# EAGLE design ac and dc measurement (EAGLE 6.2)
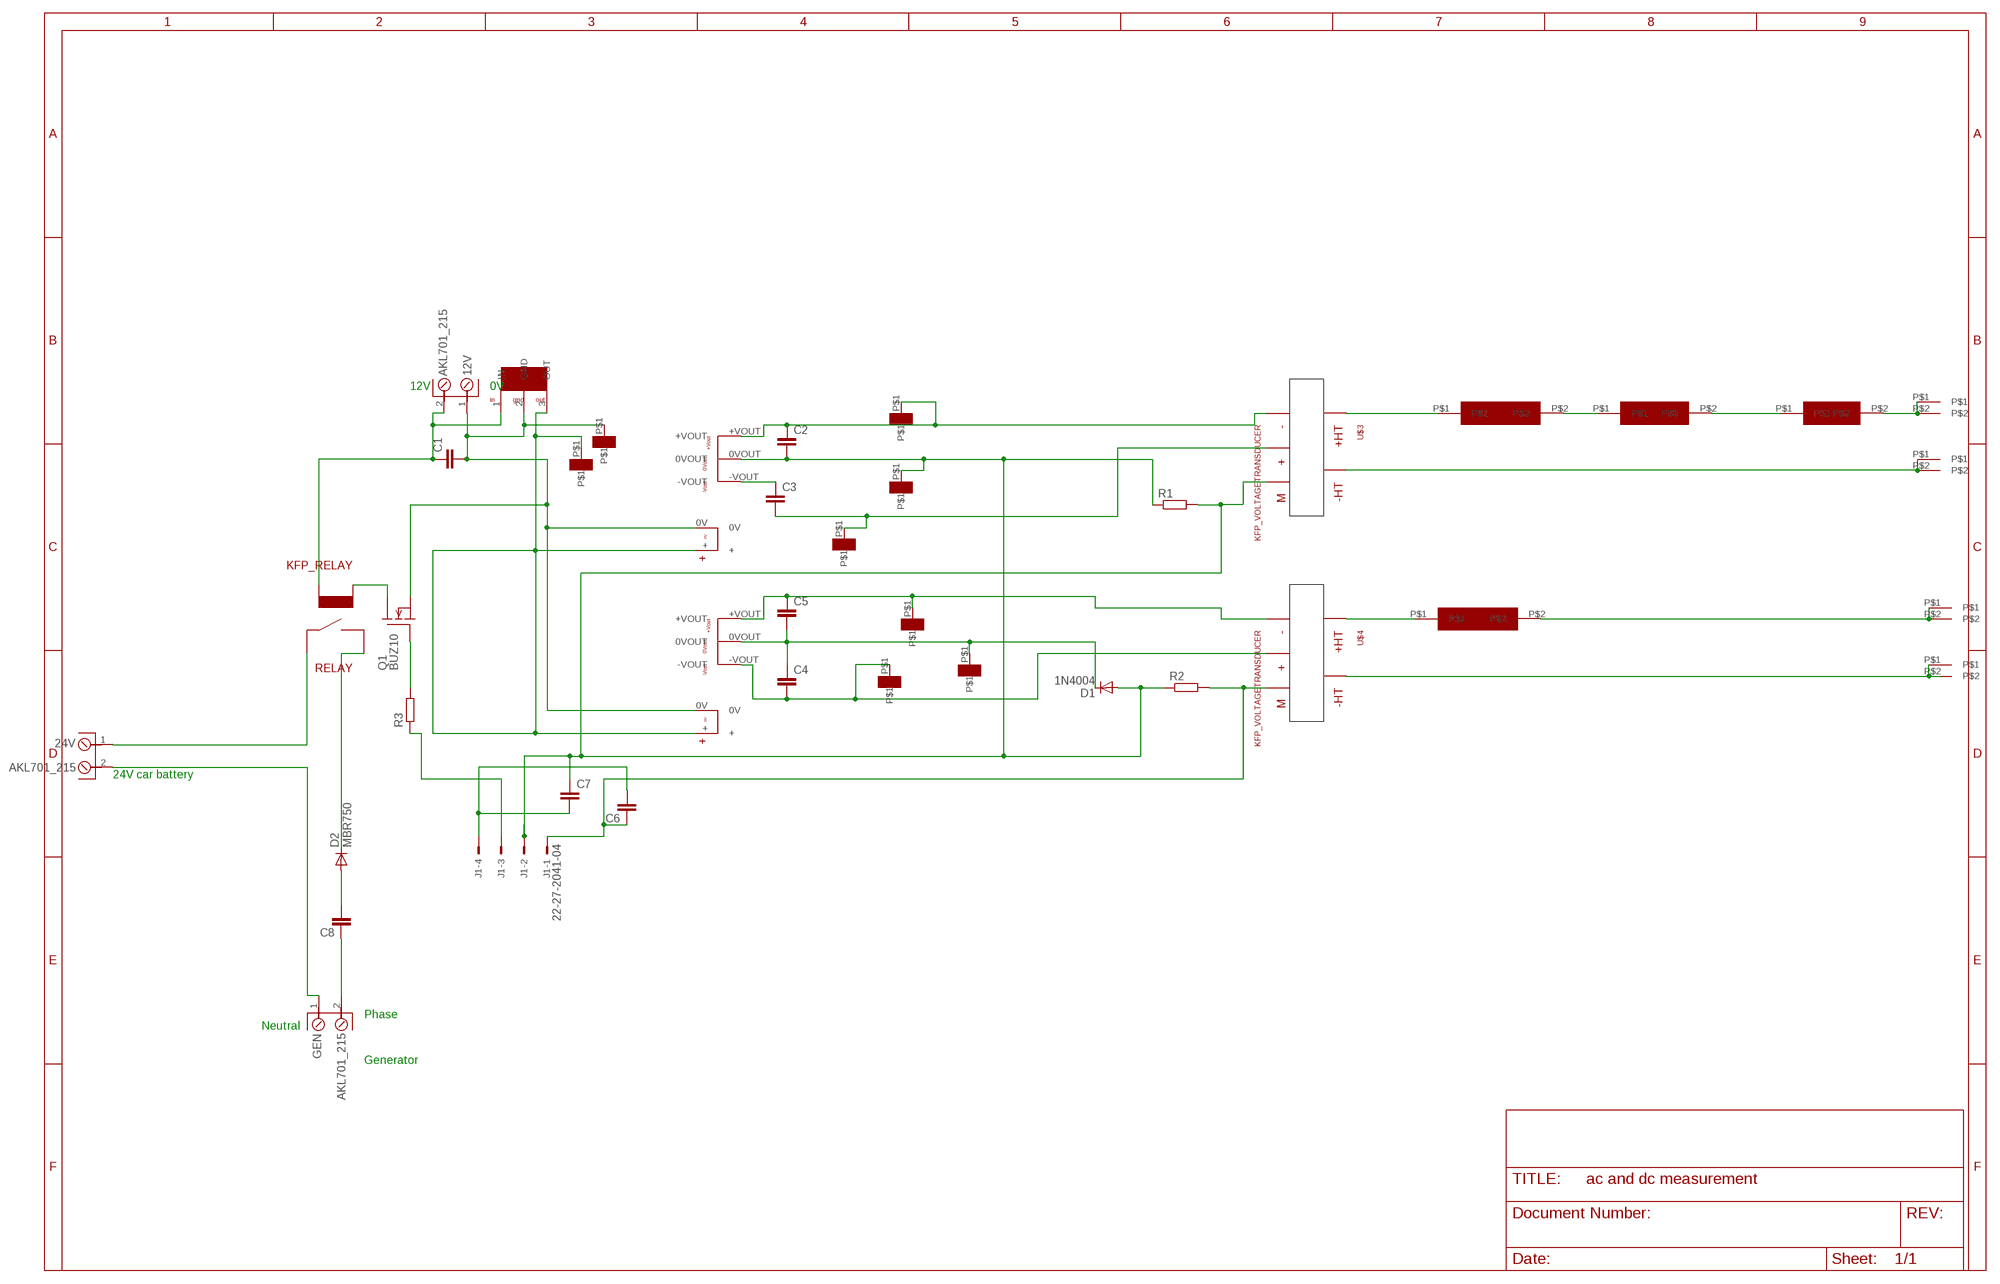
[diagram p0: schematic, sheet 1]

## Parts
5V  KFP_VOL_REG  [TO220]
12V  AKL701_215  [AKL701_2_15]
24V  AKL701_215  [AKL701_2_15]
C1  C-EU025-024X044  [C025-024X044]
C2  C-EU025-024X044  [C025-024X044]
C3  C-EU025-024X044  [C025-024X044]
C4  C-EU025-024X044  [C025-024X044]
C5  C-EU025-024X044  [C025-024X044]
C6  C-EU025-024X044  [C025-024X044]
C7  C-EU025-024X044  [C025-024X044]
C8  C-EU025-030X050  [C025-030X050]
D1  1N4004  [DO41-10]
D2  MBR750  [TO220AC]
GEN  AKL701_215  [AKL701_2_15]
J1  22-27-2041-04  [6410-04]
Q1  BUZ10  [TO220]
R1  R-EU_0204/7  [0204/7]
R2  R-EU_0204/7  [0204/7]
R3  R-EU_0204/7  [0204/7]
RELAY  KFP_RELAY  [KFP_RELAYSPST]
U$1  KFP_DC_DC  [KFP_DC-DC]
U$2  KFP_DC_DC  [KFP_DC-DC]
U$3  KFP_VOLTAGETRANSDUCER  [KFP_VOLTAGETRANSDUCER]
U$4  KFP_VOLTAGETRANSDUCER  [KFP_VOLTAGETRANSDUCER]
U$5  KFP_33K  [KFP_33K]
U$6  KFP_33K  [KFP_33K]
U$7  KFP_22K  [KFP_22K]
U$8  KFP_4.7K  [KFP_18K]
U$9  HIGH_AMP_TERMINAL  [HIGH_AMP_TERMINAL]
U$11  HIGH_AMP_TERMINAL  [HIGH_AMP_TERMINAL]
U$12  HIGH_AMP_TERMINAL  [HIGH_AMP_TERMINAL]
U$13  HIGH_AMP_TERMINAL  [HIGH_AMP_TERMINAL]
U$14  KFP_TEST  [KFP_TEST]
U$15  KFP_TEST  [KFP_TEST]
U$16  KFP_TEST  [KFP_TEST]
U$17  KFP_TEST  [KFP_TEST]
U$18  KFP_TEST  [KFP_TEST]
U$19  KFP_TEST  [KFP_TEST]
U$20  KFP_TEST  [KFP_TEST]
U$21  KFP_TEST  [KFP_TEST]

## Nets
N$1: 5V.2(GND) 12V.1 C1.2 Q1.3(S) U$1.0V U$2.0V U$21.P$1
N$2: 5V.3(OUT) U$1.+ U$2.+ U$16.P$1
N$3: C3.2 U$3.+ U$14.P$1
N$4: C4.2 U$2.-VOUT U$4.+ U$18.P$1
N$5: C6.2 C7.2 J1.4
N$6: C2.1 U$1.+VOUT U$3.- U$15.P$1
N$7: C4.1 C5.2 D1.C U$2.0VOUT U$20.P$1
N$8: C5.1 U$2.+VOUT U$4.- U$17.P$1
N$9: 24V.2 GEN.1
N$10 [AC]: U$4.+HT](+HT) U$5.P$1
N$11: C6.1 J1.1 R2.2 U$4.M
N$12 [DC LINK]: U$3.+HT](+HT) U$6.P$1
N$13 [DC LINK]: U$6.P$2 U$7.P$1
N$14: Q1.2(D) RELAY.A1
N$15 [AC]: U$5.P$2 U$12.P$1 U$12.P$2
N$16 [AC]: U$4.-HT U$13.P$1 U$13.P$2
N$17: Q1.1(G) R3.2
N$18 [DC LINK]: U$3.-HT U$11.P$1 U$11.P$2
N$19: C8.1 GEN.2
N$20: C8.2 D2.A
N$21: U$8.P$2 U$9.P$1 U$9.P$2
N$22: C2.2 C7.1 D1.A J1.2 R1.1 R1.2 R2.1 U$1.0VOUT U$3.M U$19.P$1
N$23: C3.1 U$1.-VOUT
N$24: J1.3 R3.1
N$25: 5V.1(IN) 12V.2 C1.1 RELAY.A2
N$26: D2.C RELAY.11
N$27: 24V.1 RELAY.14
RESISTOR [DC LINK]: U$7.P$2 U$8.P$1

## Notes on the sheet
- 12V | 0V
- 24V car battery
- Phase
- Neutral
- Generator

## Library data of the parts
5V = kfp_vol_reg:KFP_VOL_REG
12V 24V GEN = _con_riacon_akl701:AKL701_2*: RIACON (Ria Connect) Screw Type Terminal Block Type AKL 701 - 2 (pole-size: 2) centerline 6.35 mm / 0.250 inches, 400 V / 24 A, horizontal wire entry, lift system, modular packages: _13: recommended pcb hole dia. = 1,3 mm _15: pcb hole dia. = 1,5 mm (prototyping) Auhtor: Dipl.-Ing. FH Rainer Bayer, Hochschule Heilbronn (rainer.bayer@hs-heilbronn.de)
C1-C8 = resistor:C-EU: CAPACITOR, European symbol
D1 = diode:1N4004: DIODE general purpose rectifier, 1 A
D2 = diode:MBR750: DIODE barrier rectifier, 7.5 A, 50 V
J1 = con-molex:22-?-04: CONNECTOR wire to board 2.54 mm (.1 inch) pitch header; OC_FARNELL: unknown; OC_NEWARK: unknown
Q1 = transistor-fet:BUZ10: N-Channel Enhancement MOSFET 50V; 20A; 0,080Ohm
R1-R3 = resistor:R-EU_: RESISTOR, European symbol
RELAY = kfp_relaynew:KFP_RELAY
U$1 U$2 = kfp_ac-dc:KFP_DC_DC
U$3 U$4 = KFP_VOLTAGE TRANSDUCER_1:KFP_VOLTAGETRANSDUCER
U$5 U$6 = kfp_33k_5W:KFP_33K
U$7 = kfp_22k_3W:KFP_22K
U$8 = kfp_4.7k_3W:KFP_4.7K
U$9 U$11-U$13 = rectifier_components:HIGH_AMP_TERMINAL
U$14-U$21 = KFP_TEST:KFP_TEST

## Net classes
1 24V path: width 2.413 mm
2 DC LINK: width 0 mm, clearance 3.632 mm
3 AC: width 0.003 mm, clearance 2.362 mm

## Board
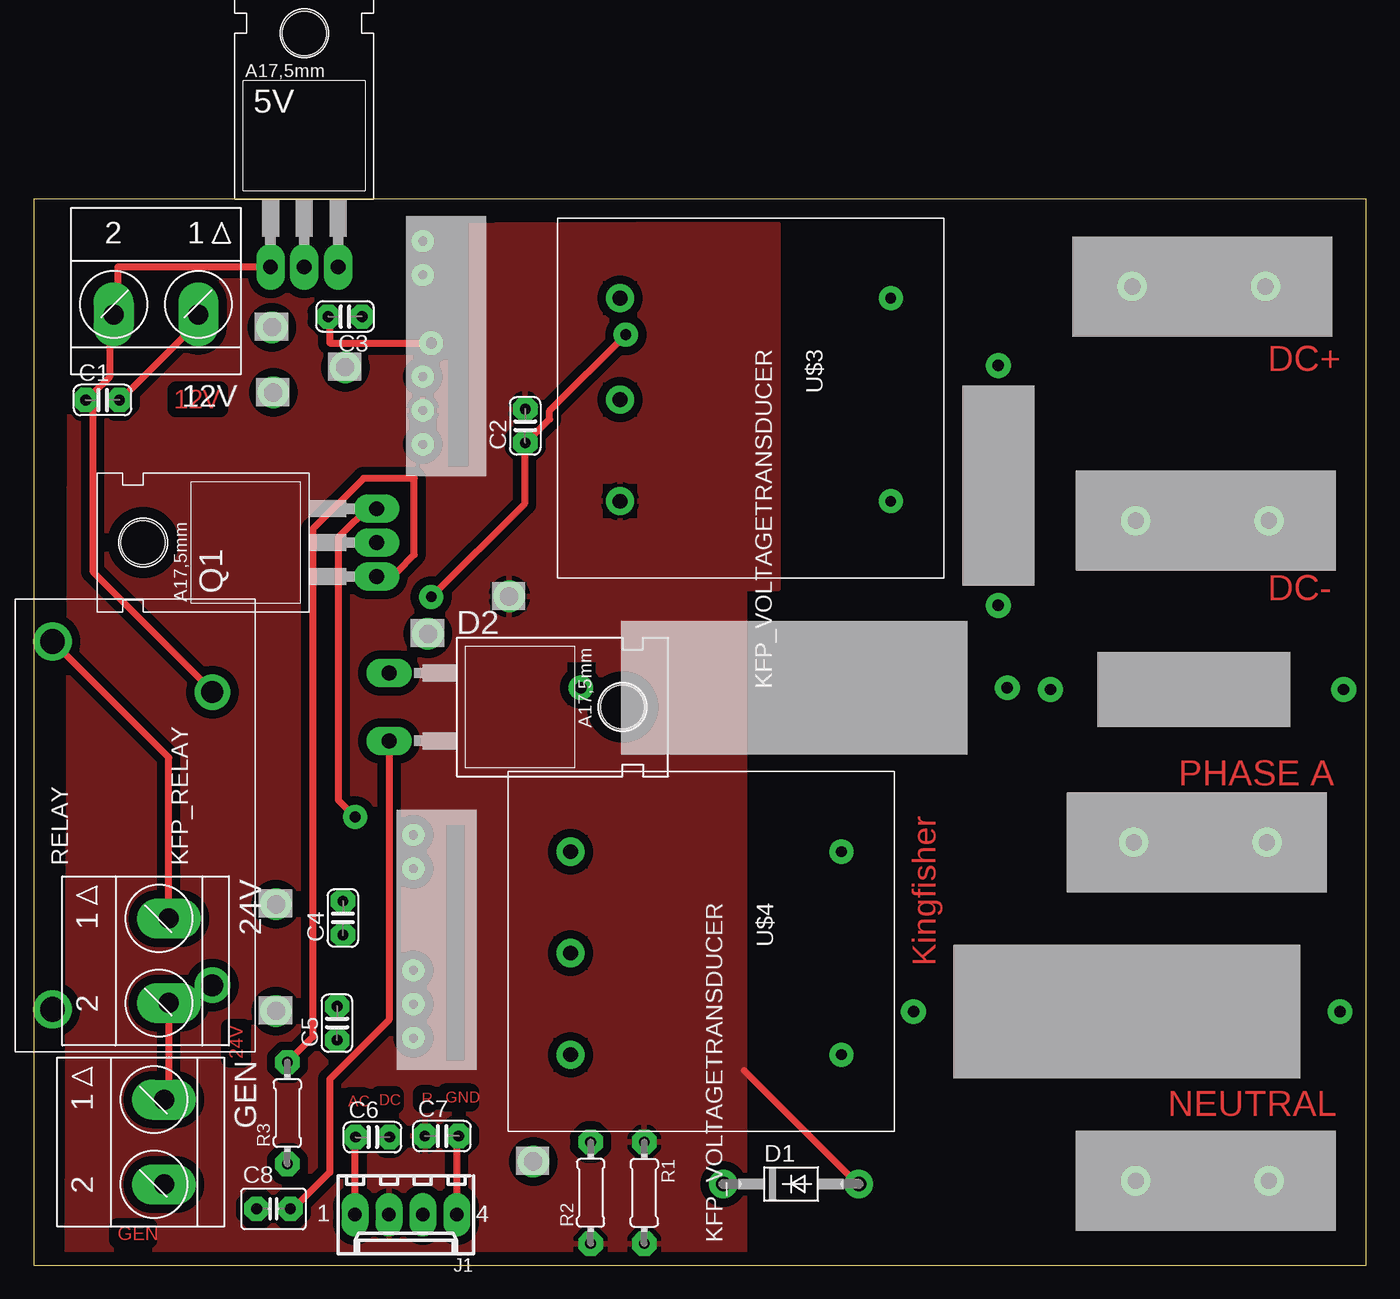
[diagram p1: board, top side]
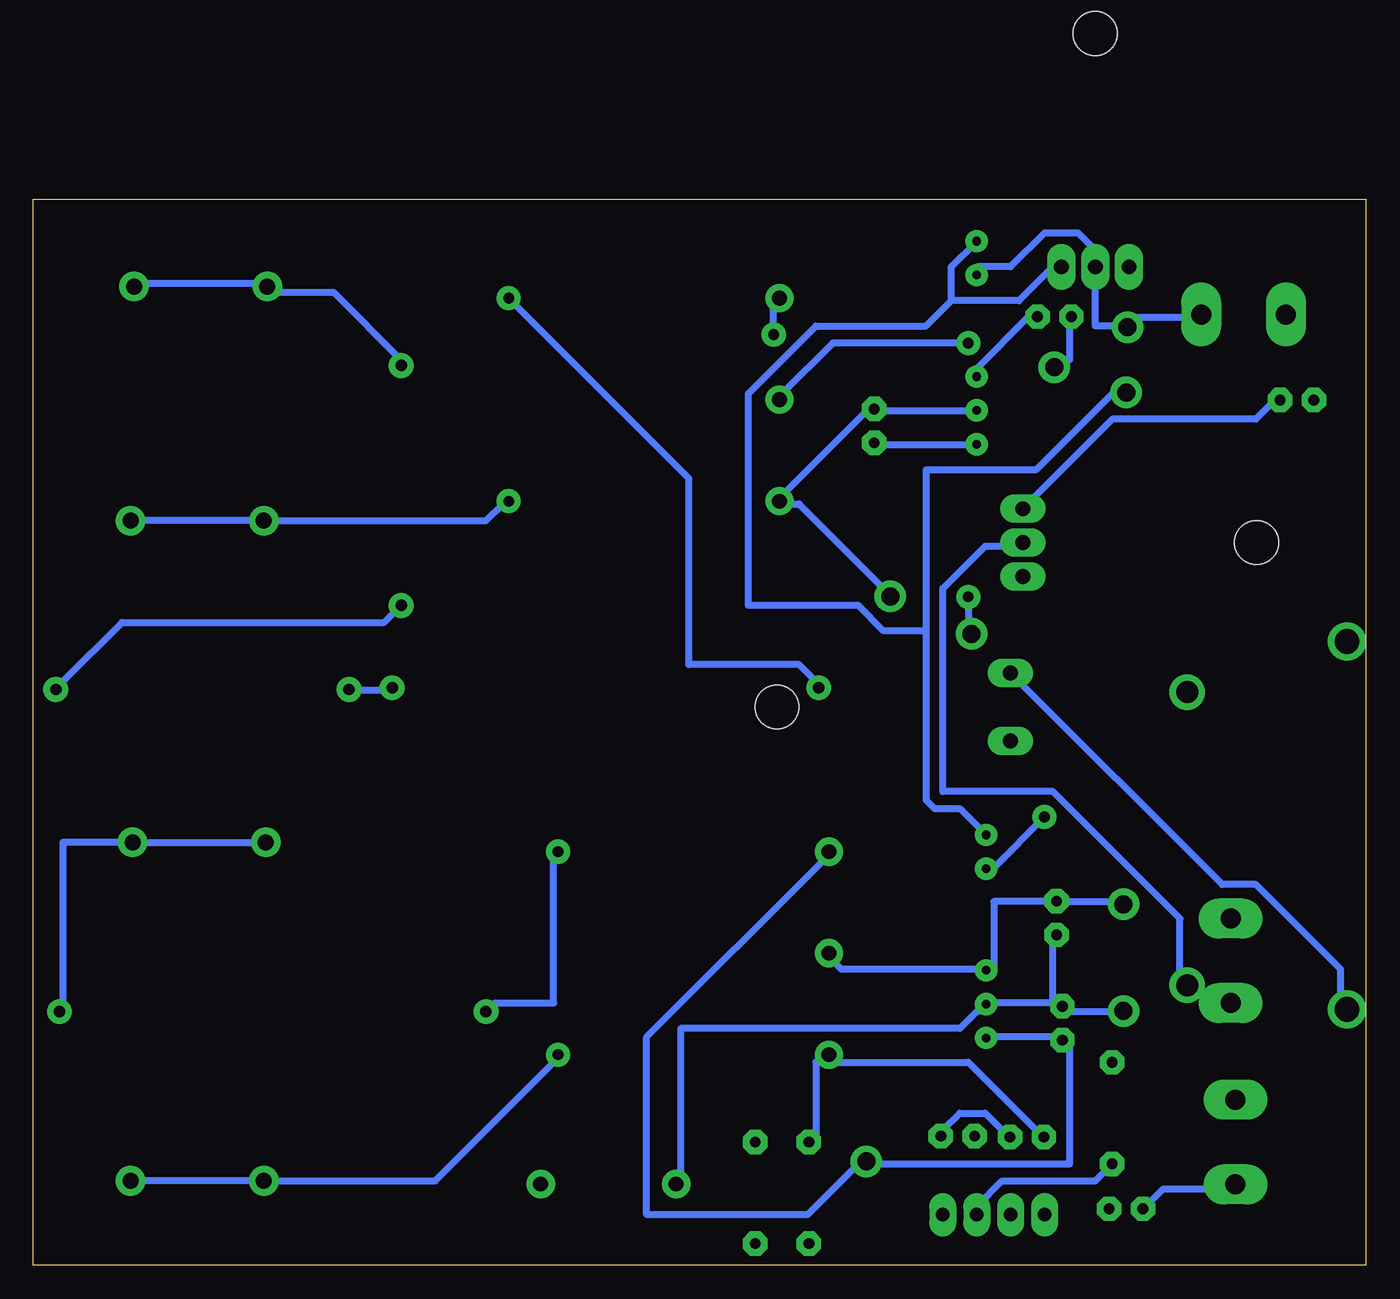
[diagram p2: board, bottom side, seen from below]

Size 100 x 80 mm. Coordinates in mm from the lower left corner, seen from the top.
Outline: 0,0 100,0 100,80 0,80 0,0
Copper layers (1*16): Top 0.035mm / dielectric 1.5mm / Bottom 0.035mm
Design rules: minimum track width 20mil, minimum drill 0.8mm, track to track 25mil, track to pad 20mil, pad to pad 15mil, via to via 20mil, smd to smd 0mil, copper to edge 40mil, drill to drill 10mil, minimum pad ring 20mil, minimum via ring 20mil, stop-mask expansion 0mil, vias tented up to drill 0mil, thermal gap 15mil
tRestrict: area 31.1,60 to 32.6,78; area 31,15.4 to 32.3,33

### Footprints (pad centres in the part's own frame; a part is rotated, then mirrored left to right if it is on the bottom)
TO220 = drill 1.118 long: 1 -2.54,-6.35; 2 0,-6.35; 3 2.54,-6.35 | hole 3.302: 0,11.176
AKL701_2_15 = drill 1.5 pad 3 long: 1 -3.175,0; 2 3.175,0
C025-024X044 = drill 0.813 octagon: 1 -1.27,0; 2 1.27,0
C025-030X050 = drill 0.813 octagon: 1 -1.27,0; 2 1.27,0
DO41-10 = drill 1.118: A 5.08,0; C -5.08,0
TO220AC = drill 1.118 long: A 2.54,-6.35; C -2.54,-6.35 | hole 3.302: 0,11.176
6410-04 = drill 1.016 long: 1 3.81,0; 2 1.27,0; 3 -1.27,0; 4 -3.81,0
0204/7 = drill 0.813 octagon: 1 -3.81,0; 2 3.81,0
KFP_RELAYSPST = drill 1.85: 11 -13.8,6.2; 14 13.8,6.2 | drill 1.65: A1 -12,-5.8; A2 10,-5.8
KFP_DC-DC = drill 0.65: 0V 4.42,0; 0VOUT 14.58,0; + 1.88,0; +VOUT 17.12,0; -VOUT 12.04,0
KFP_VOLTAGETRANSDUCER = drill 1.1: + 7.62,-20.32; - 0,-20.32; M 15.24,-20.32 | drill 0.8: +HT] 0,0; -HT 15.24,0
KFP_33K = drill 0.85: P$1 0,0; P$2 32,0
KFP_22K = drill 0.85: P$1 0,0; P$2 22,0
KFP_18K = drill 0.85: P$1 0,0; P$2 18,0
HIGH_AMP_TERMINAL = drill 1.2: P$1 0,0; P$2 10,0
KFP_TEST = drill 1.35: P$1 0,0

### Placement (x,y rotation side)
5V  20.32,81.28 0 top
12V  9.19,71.36 180 top
24V  10.16,22.86 270 top
C1  5.18,64.94 0 top
C2  36.9,63 90 top
C3  23.38,71.2 180 top
C4  23.22,26.07 90 top
C5  22.78,18.18 90 top
C6  25.44,9.63 0 top
C7  30.64,9.71 0 top
C8  18.01,4.25 0 top
D1  56.85,6.11 0 top
D2  33.02,41.91 270 top
GEN  9.79,9.26 270 top
J1  27.94,3.81 180 top
Q1  19.4,54.24 90 top
R1  45.83,5.45 270 top
R2  41.81,5.45 90 top
R3  19.05,11.43 90 top
RELAY  7.62,33.02 90 top
U$1  29.21,78.74 270 top
U$2  28.5,34.19 270 top
U$3  64.33,72.59 270 top
U$4  60.62,31.05 270 top
U$5  66.04,19.05 0 top
U$6  41.07,43.35 0 top
U$7  76.31,43.22 0 top
U$8  72.39,49.53 90 top
U$9  92.44,73.46 180 top
U$11  92.71,55.88 180 top
U$12  82.55,31.75 0 top
U$13  92.71,6.35 180 top
U$14  23.4,67.4 0 top
U$15  29.6,47.4 0 top
U$16  18,65.5 0 top
U$17  37.5,7.8 0 top
U$18  18.2,27.1 0 top
U$19  35.7,50.2 0 top
U$20  18.2,19.1 0 top
U$21  17.9,70.4 0 top

### Tracks (layer width: path | path; a pad name or v marks a point on that pad's centre or on a via)
N$1  (via drill 0.8)
  Top 0.508: v24.13,33.66 22.86,34.92 22.86,54.61 25.4,57.15 Q1.3 | C1.2 6.99,65.41 12.06,70.48 12.06,71.12 12V.1
  Bottom 0.508: v24.13,33.66 27.94,29.84 U$2.0V | U$1.0V 29.21,74.93 26.67,74.93 24.13,77.47 21.59,77.47 20.32,76.2 5V.2 20.32,70.48 18.41,70.48 U$21.P$1 17.78,70.48 17.14,71.12 12.7,71.12 12V.1 | Q1.3 25.4,57.15 19.05,63.5 8.26,63.5 6.99,64.77 C1.2
N$2
  Bottom 0.508: 31.11,72.39 31.11,74.93 29.21,76.83 U$1.+ | 31.11,72.39 26.04,72.39 23.5,74.93 5V.3 | 33.02,47.62 33.02,59.69 24.77,59.69 19.05,65.41 18.41,65.41 U$16.P$1 | 33.02,47.62 33.02,34.92 32.38,34.29 30.48,34.29 28.57,32.38 U$2.+ | 31.11,72.39 33.02,70.48 41.27,70.48 46.35,65.41 46.35,49.53 38.1,49.53 36.2,47.62 33.02,47.62
N$3  (via drill 0.8)
  Top 0.508: v29.84,69.22 22.23,69.22 22.23,71.12 C3.2
  Bottom 0.508: C3.2 22.23,71.12 22.23,67.94 22.86,67.94 U$14.P$1 | v29.84,69.22 40.01,69.22 43.81,65.41 U$3.+
N$4
  Bottom 0.508: U$4.+ 40.01,22.86 39.37,22.23 28.57,22.23 U$2.-VOUT 27.94,22.23 27.94,27.3 23.5,27.3 C4.2 22.86,27.3 18.41,27.3 U$18.P$1
N$5
  Top 0.508: J1.4 31.75,9.53 C7.2
  Bottom 0.508: C6.2 27.3,10.16 28.57,11.43 30.48,11.43 31.75,10.16 C7.2
N$6  (via drill 0.8)
  Top 0.508: v44.45,69.85 38.73,64.14 38.73,63.5 37.47,62.23 C2.1 36.83,61.59 36.83,57.15 v29.84,50.16
  Bottom 0.508: U$1.+VOUT 29.21,61.59 36.83,61.59 C2.1 | v44.45,69.85 44.45,72.39 U$3.- | v29.84,50.16 29.84,47.62 U$15.P$1
N$7
  Bottom 0.508: 23.5,19.68 22.86,19.68 C5.2 | 23.5,19.68 27.94,19.68 U$2.0VOUT 28.57,19.05 29.21,19.05 30.48,17.78 51.44,17.78 51.44,6.35 D1.C | 23.5,19.68 23.5,24.77 C4.1 | 23.5,19.68 C5.2 | U$20.P$1 18.41,19.05 22.23,19.05 C5.2
N$8
  Bottom 0.508: U$2.+VOUT 27.94,17.14 22.86,17.14 C5.1 22.23,16.51 22.23,7.62 37.47,7.62 U$17.P$1 38.1,7.62 41.91,3.81 53.98,3.81 53.98,17.14 40.64,30.48 U$4.-
N$9
  Top 0.508: 24V.2 10.16,12.7 GEN.1
N$10
  Bottom 0.508: U$5.P$1 65.41,19.68 60.96,19.68 60.96,30.48 U$4.+HT]
N$11
  Top 0.508: J1.1 24.13,9.53 C6.1
  Bottom 0.508: R2.2 41.27,9.53 41.27,15.24 40.64,15.24 U$4.M 40.01,15.24 29.84,15.24 24.77,10.16 C6.1
N$12
  Bottom 0.508: U$3.+HT] 64.14,72.39 50.8,59.05 50.8,45.09 42.55,45.09 41.27,43.81 U$6.P$1
N$13
  Bottom 0.508: U$6.P$2 73.66,43.18 76.2,43.18 U$7.P$1
N$14
  Bottom 0.508: Q1.2 26.04,53.98 28.57,53.98 31.75,50.8 31.75,35.56 23.5,35.56 13.97,26.04 13.97,21.59 RELAY.A1
N$15
  Bottom 0.508: U$5.P$2 97.79,19.05 97.79,31.75 U$12.P$2 U$12.P$1
N$16
  Bottom 0.508: U$4.-HT 60.96,15.24 69.85,6.35 U$13.P$2 U$13.P$1
N$17
  Top 0.508: R3.2 20.95,17.14 20.95,55.24 24.77,59.05 28.57,59.05 28.57,53.34 27.3,52.07 26.04,52.07 Q1.1
N$18
  Bottom 0.508: U$3.-HT 64.77,57.15 66.04,55.88 U$11.P$2 U$11.P$1
N$19
  Bottom 0.508: C8.1 16.51,4.45 15.24,5.71 10.16,5.71 GEN.2
N$20
  Top 0.508: D2.A 26.67,18.41 22.23,13.97 22.23,6.99 19.68,4.45 C8.2
N$21
  Bottom 0.508: U$8.P$2 72.39,67.94 77.47,73.03 81.92,73.03 U$9.P$2 82.55,73.66 92.08,73.66 U$9.P$1
N$22
  Top 0.508: 53.34,14.61 61.59,6.35 D1.A
  Bottom 0.508: U$1.0VOUT 29.21,64.14 36.83,64.14 C2.2 37.47,64.14 43.81,57.78 U$3.M 43.81,57.15 42.55,57.15 36.2,50.8 U$19.P$1
  pour Top: 2.74,77.94 55.88,78.14 55.88,50.8 53.34,50.8 53.34,0 2.54,0
N$23
  Bottom 0.508: U$1.-VOUT 29.21,67.31 25.4,71.12 24.77,71.12 C3.1
N$24
  Bottom 0.508: R3.1 20.32,6.35 27.3,6.35 29.21,4.45 J1.3
N$25
  Top 0.508: 5V.1 6.35,74.93 6.35,71.75 12V.2 5.71,71.12 5.71,66.67 4.45,65.41 C1.1 4.45,64.77 4.45,52.07 13.34,43.18 RELAY.A2
N$26
  Bottom 0.508: D2.C 10.79,28.57 8.26,28.57 1.91,22.23 1.91,19.68 RELAY.11
N$27
  Top 0.508: 24V.1 10.16,38.1 1.91,46.35 RELAY.14
RESISTOR
  Bottom 0.508: U$8.P$1 73.66,48.26 93.34,48.26 97.79,43.81 U$7.P$2

### Text on the board
Top: DC+ | 12V | DC- | PHASE A | Kingfisher | 24V | AC | DC | R | GND | NEUTRAL | GEN